# EAGLE design Soraduino_logsc (EAGLE 6.5.0)
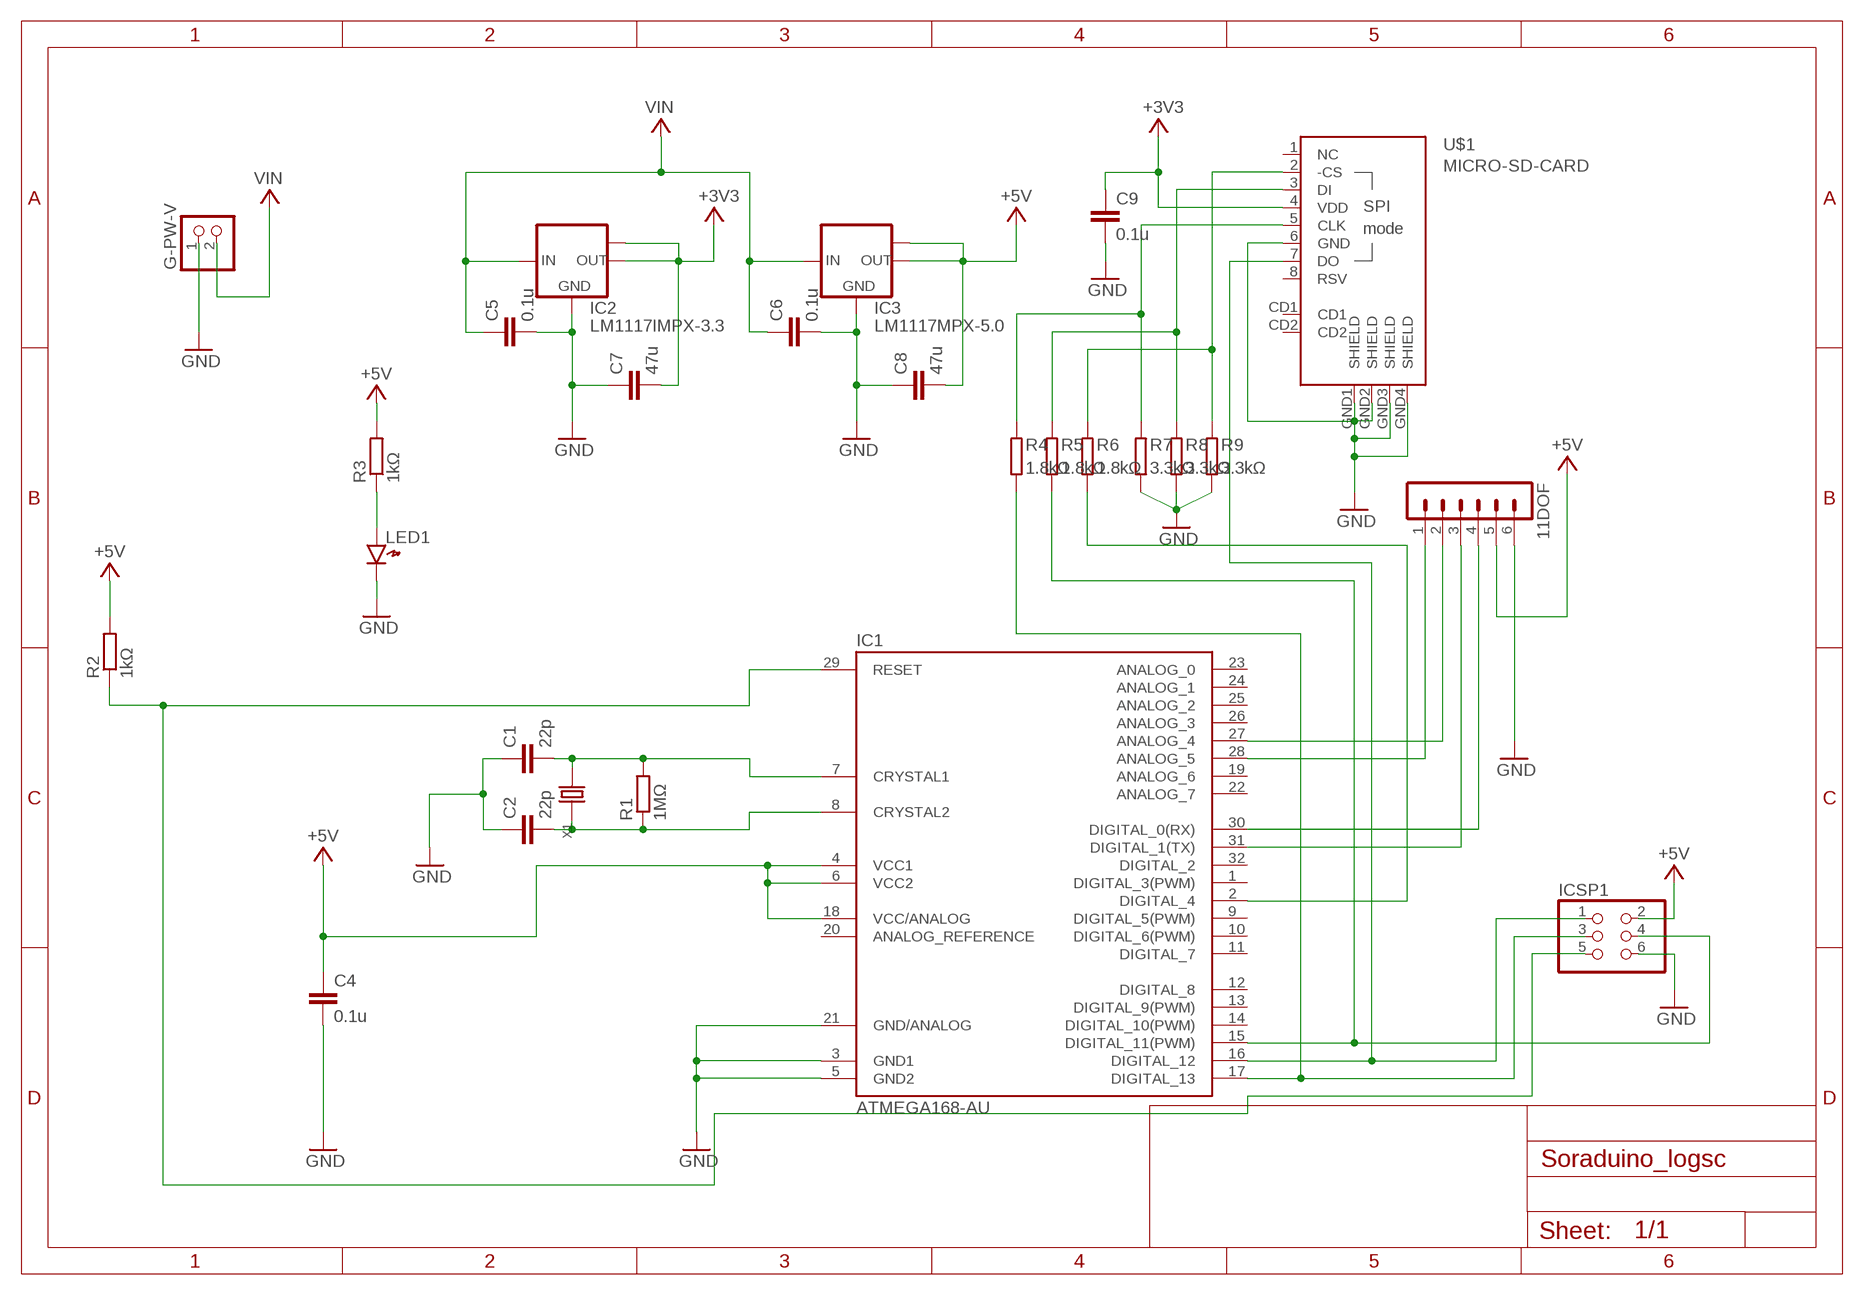
[diagram p0: schematic, sheet 1]

## Parts
11DOF  MA06-1  [MA06-1]
C1  22p  C-EUC1608  [C1608]
C2  22p  C-EUC1608  [C1608]
C4  0.1u  C-EUC2012  [C2012]
C5  0.1u  C-EUC2012  [C2012]
C6  0.1u  C-EUC2012  [C2012]
C7  47u  C-EUC3225  [C3225]
C8  47u  C-EUC3225  [C3225]
C9  0.1u  C-EUC2012  [C2012]
G-PW-V  PINHD-1X2  [1X02]
IC1  ATMEGA168-AU  [TQFP32-08]
IC2  LM1117IMPX-3.3  [SOT223]
IC3  LM1117MPX-5.0  [SOT223]
ICSP1  PINHD-2X3  [2X03]
LED1  LED1608  [LED1608]
R1  1MΩ  R-EU_R0603  [R0603]
R2  1kΩ  R-EU_R0603  [R0603]
R3  1kΩ  R-EU_R0603  [R0603]
R4  1.8kΩ  RESISTOR1608  [SMD1608]
R5  1.8kΩ  RESISTOR1608  [SMD1608]
R6  1.8kΩ  RESISTOR1608  [SMD1608]
R7  3.3kΩ  RESISTOR1608  [SMD1608]
R8  3.3kΩ  RESISTOR1608  [SMD1608]
R9  3.3kΩ  RESISTOR1608  [SMD1608]
U$1  MICRO-SD-CARD  [DM3AT-SF-PEJ]
X1  CRYSTAL'3225'  [4P-SMD-3.2X2.5]

## Nets
+3V3: C7.2 C9.1 IC2.2(OUT) IC2.TAB(OUT1) U$1.4(VDD)
+5V: 11DOF.5 C4.1 C8.2 IC1.4(VCC1) IC1.6(VCC2) IC1.18(VCC/ANALOG) IC3.2(OUT) IC3.TAB(OUT1) ICSP1.2 R2.2 R3.2
GND: 11DOF.6 C1.1 C2.1 C4.2 C5.2 C6.2 C7.1 C8.1 C9.2 G-PW-V.1 IC1.3(GND1) IC1.5(GND2) IC1.21(GND/ANALOG) IC2.1(GND) IC3.1(GND) ICSP1.6 LED1.K R7.2 R8.2 R9.2 U$1.6(GND) U$1.GND1(SHIELD) U$1.GND2(SHIELD) U$1.GND3(SHIELD) U$1.GND4(SHIELD)
N$1: C1.2 IC1.7(CRYSTAL1) R1.2 X1.4
N$2: C2.2 IC1.8(CRYSTAL2) R1.1 X1.2
N$3: 11DOF.1 IC1.28(ANALOG_5)
N$4: IC1.29(RESET) ICSP1.5 R2.1
N$6: 11DOF.4 IC1.30(DIGITAL_0(RX))
N$7: LED1.A R3.1
N$8: 11DOF.2 IC1.27(ANALOG_4)
N$10: R4.1 R7.1 U$1.5(CLK)
N$11: IC1.2(DIGITAL_4) R6.2
N$12: R5.1 R8.1 U$1.3(DI)
N$13: R6.1 R9.1 U$1.2(-CS)
N$14: IC1.15(DIGITAL_11(PWM)) ICSP1.4 R5.2
N$15: IC1.16(DIGITAL_12) ICSP1.1 U$1.7(DO)
N$16: IC1.17(DIGITAL_13) ICSP1.3 R4.2
N$17: 11DOF.3 IC1.31(DIGITAL_1(TX))
VCC: C5.1 C6.1 G-PW-V.2 IC2.3(IN) IC3.3(IN) ; supply symbol labelled VIN
Unconnected: IC1.1(DIGITAL_3(PWM)) IC1.9(DIGITAL_5(PWM)) IC1.10(DIGITAL_6(PWM)) IC1.11(DIGITAL_7) IC1.12(DIGITAL_8) IC1.13(DIGITAL_9(PWM)) IC1.14(DIGITAL_10(PWM)) IC1.19(ANALOG_6) IC1.20(ANALOG_REFERENCE) IC1.22(ANALOG_7) IC1.23(ANALOG_0) IC1.24(ANALOG_1) IC1.25(ANALOG_2) IC1.26(ANALOG_3) IC1.32(DIGITAL_2) U$1.1(NC) U$1.8(RSV) U$1.CD1 U$1.CD2

## Library data of the parts
11DOF = con-lstb:MA06-1: PIN HEADER; OC_FARNELL: unknown; OC_NEWARK: unknown
C1 C2 C4-C9 = rcl:C-EU: CAPACITOR, European symbol
G-PW-V = pinhead:PINHD-1X2: PIN HEADER
IC1 = Arduino-AVR:ATMEGA168
IC2 = lm1117:LM1117IMPX-*
IC3 = lm1117:LM1117MPX-*
ICSP1 = pinhead:PINHD-2X3: PIN HEADER
LED1 = generic:LED: Generic LEDs
R1-R3 = rcl:R-EU_: RESISTOR, European symbol
R4-R9 = generic:RESISTOR: Generic Registor
U$1 = micro_sd:MICRO-SD-CARD: HIROSE microSD socket DM3AT-SF-PEJ
X1 = Discrete:CRYSTAL*: CRYSTAL

## Board
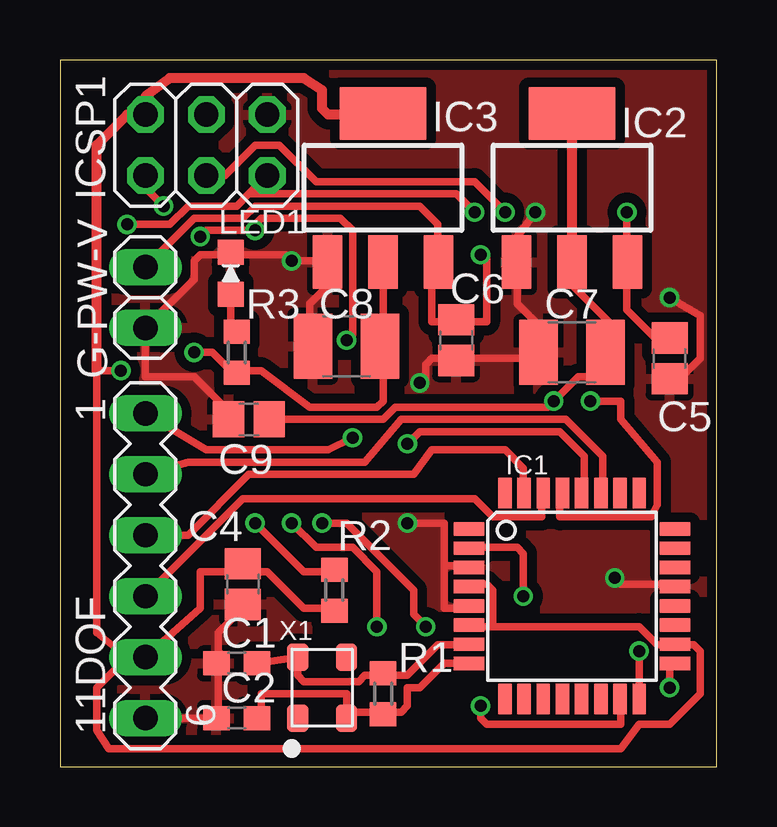
[diagram p1: board, top side]
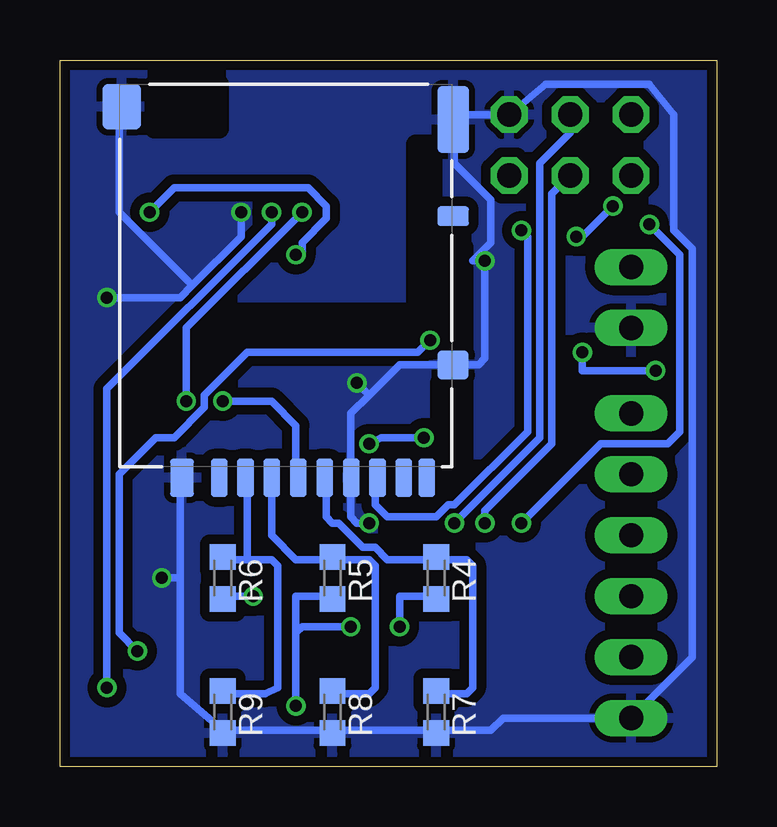
[diagram p2: board, bottom side, seen from below]

Size 27.36 x 29.45 mm. Coordinates in mm from the lower left corner, seen from the top.
Outline: 0,0 27.36,0 27.36,29.45 0,29.45 0,0
Copper layers (1*16): Top 0.035mm / dielectric 0.2mm / Bottom 0.035mm
Design rules "SeeedStudio_DRU_no_angle_20130527": minimum track width 6mil, minimum drill 12mil, track to track 6mil, track to pad 6mil, pad to pad 6mil, via to via 6mil, smd to smd 0mil, copper to edge 10mil, drill to drill 10mil, minimum pad ring 6mil, minimum via ring 6mil, stop-mask expansion 2mil, vias tented up to drill 25mil, thermal gap 10mil

### Footprints (pad centres in the part's own frame; a part is rotated, then mirrored left to right if it is on the bottom)
MA06-1 = drill 1.016 long: 1 -6.35,0; 2 -3.81,0; 3 -1.27,0; 4 1.27,0; 5 3.81,0; 6 6.35,0
C1608 = smd 1.1 x 1: 1 -0.85,0; 2 0.85,0
C2012 = smd 1.3 x 1.5: 1 -0.85,0; 2 0.85,0
C3225 = smd 1.6 x 2.7: 1 -1.4,0; 2 1.4,0
1X02 = drill 1.016 long: 1 -1.27,0; 2 1.27,0
TQFP32-08 = smd 1.27 x 0.559: 1 -4.293,2.8; 2 -4.293,2; 3 -4.293,1.2; 4 -4.293,0.4; 5 -4.293,-0.4; 6 -4.293,-1.2; 7 -4.293,-2; 8 -4.293,-2.8; 17 4.293,-2.8; 18 4.293,-2; 19 4.293,-1.2; 20 4.293,-0.4; 21 4.293,0.4; 22 4.293,1.2; 23 4.293,2; 24 4.293,2.8 | smd 0.559 x 1.27: 9 -2.8,-4.293; 10 -2,-4.293; 11 -1.2,-4.293; 12 -0.4,-4.293; 13 0.4,-4.293; 14 1.2,-4.293; 15 2,-4.293; 16 2.8,-4.293; 25 2.8,4.293; 26 2,4.293; 27 1.2,4.293; 28 0.4,4.293; 29 -0.4,4.293; 30 -1.2,4.293; 31 -2,4.293; 32 -2.8,4.293
SOT223 = smd 1.219 x 2.235: 1 -2.311,-3.099; 2 0,-3.099; 3 2.311,-3.099 | smd 3.6 x 2.2: TAB 0,3.099
2X03 = drill 1.016 octagon: 1 -2.54,-1.27; 2 -2.54,1.27; 3 0,-1.27; 4 0,1.27; 5 2.54,-1.27; 6 2.54,1.27
LED1608 = smd 1.05 x 1.08: A -0.875,0; K 0.875,0
R0603 = smd 1 x 1.1: 1 -0.85,0; 2 0.85,0
SMD1608 = smd 1.05 x 1.08: 1 -0.875,0; 2 0.875,0
DM3AT-SF-PEJ = smd 0.7 x 1.6: 1 3.2,16.4; 2 2.1,16.4; 3 1,16.4; 4 -0.1,16.4; 5 -1.2,16.4; 6 -2.3,16.4; 7 -3.4,16.4; 8 -4.5,16.4; CD1 -5.45,16.4 | smd 1.3 x 0.8: CD2 -6.55,5.5 | smd 1.3 x 2.8: GND1 -6.55,1.475 | smd 1.6 x 1.9: GND2 7.25,0.95 | smd 1 x 1.6: GND3 4.75,16.4 | smd 1.3 x 1.2: GND4 -6.55,11.7
4P-SMD-3.2X2.5 = smd 1.143 x 0.889: 1 -1.27,1.016; 2 -1.27,-1.016; 3 1.27,-1.016; 4 1.27,1.016

### Placement (x,y rotation side)
11DOF  3.56,8.38 270 top
C1  7.37,4.32 0 top
C2  7.37,2.03 0 top
C4  7.62,7.62 270 top
C5  25.4,17.02 270 top
C6  16.51,17.78 270 top
C7  21.34,17.27 0 top
C8  11.94,17.53 0 top
C9  7.87,14.48 180 top
G-PW-V  3.56,19.56 90 top
IC1  21.34,7.11 0 top
IC2  21.34,24.13 0 top
IC3  13.46,24.13 0 top
ICSP1  6.1,25.91 0 top
LED1  7.11,20.57 90 top
R1  13.46,3.05 90 top
R2  11.43,7.37 270 top
R3  7.37,17.27 270 top
R4  11.68,7.87 270 bottom
R5  16,7.87 270 bottom
R6  20.57,7.87 270 bottom
R7  11.68,2.29 270 bottom
R8  16,2.29 270 bottom
R9  20.57,2.29 270 bottom
U$1  17.53,28.45 180 bottom
X1  10.92,3.3 90 top

### Tracks (layer width: path | path; a pad name or v marks a point on that pad's centre or on a via)
+3V3  (via drill 0.5 pad 0.3)
  Top 0.305: 22.86,17.27 22.86,18.54 21.34,20.07 IC2.2 | 21.34,26.92 21.08,27.18 21.34,27.43 | 22.86,17.27 22.86,16.51 22.61,16.26 21.59,16.26 v20.57,15.24 20.32,14.99 13.97,14.99 13.46,14.48 C9.1 8.64,14.48 | 22.86,17.27 C7.2
  Top 0.406: 21.34,27.43 IC2.TAB 21.34,26.92 IC2.2
  Bottom 0.305: v20.57,15.24 18.54,15.24 17.53,14.22 17.53,12.19 U$1.4
+5V  (via drill 0.5 pad 0.3)
  Top 0.305: 18.03,5.84 17.27,5.84 IC1.6 | 18.03,5.84 24.13,5.84 24.89,5.08 25.4,5.08 IC1.18 25.65,5.08 26.42,5.08 26.67,4.83 26.67,3.05 25.4,1.78 24.13,1.78 23.37,0.76 2.03,0.76 1.52,1.52 1.52,3.3 2.79,4.57 | 13.46,17.53 IC3.2 | 7.11,16.51 8.38,16.51 10.41,14.99 13.21,14.99 13.46,15.24 13.46,17.53 | 13.46,17.53 C8.2 | 2.79,4.57 1.52,5.59 1.52,16.51 v2.54,16.51 | 18.03,5.84 18.03,7.37 17.78,7.62 17.27,7.62 IC1.4 | 7.87,8.13 8.64,8.13 10.16,6.6 11.43,6.6 R2.2 | 2.79,4.57 11DOF.5 5.84,6.6 5.84,8.13 7.87,8.13 | 7.11,16.51 R3.2 | 7.87,8.13 C4.1 | 7.11,16.51 6.35,17.27 v5.59,17.27
  Top 0.406: IC3.TAB 13.46,27.18 11.18,27.18 10.92,27.43 10.92,28.19 10.16,28.7 4.57,28.7 3.56,27.94 ICSP1.2 2.79,27.18 1.52,25.91 1.52,16.51
  Bottom 0.305: v5.59,17.27 5.59,16.51 v2.54,16.51
GND  (via drill 0.5 pad 0.3)
  Top 0.305: 11DOF.6 C2.1 6.6,2.03 6.6,4.32 | 6.6,4.32 6.6,4.57 C1.1 6.6,4.32 | 7.11,21.34 9.4,21.34 v9.65,21.08 10.92,21.08 IC3.1 11.18,20.83 11.18,20.07 10.41,19.3 10.41,17.53 C8.1 | v23.11,7.87 23.37,7.62 25.4,7.62 IC1.21 | 7.11,21.34 5.84,21.34 5.59,21.08 5.59,20.32 G-PW-V.1 3.56,16.26 5.59,16.26 7.11,14.73 7.11,14.48 C9.2 | 7.11,21.34 LED1.K | 16.51,17.02 19.81,17.02 20.07,17.27 C7.1 19.81,17.27 19.81,18.54 19.05,19.3 19.05,20.83 IC2.1 19.05,21.08 19.05,22.1 v19.81,23.11 | 16.51,17.02 15.49,17.02 15.24,16.76 15.24,16 v14.99,16 | 16.51,17.02 C6.2 | 16,8.38 17.02,8.38 IC1.3 | 16,8.38 16,6.6 17.02,6.6 IC1.5 | 16,8.38 16,10.16 v14.48,10.16 | 6.6,4.32 6.86,4.57 6.6,4.83 6.6,5.59 7.62,6.6 7.87,6.6 C4.2 | v25.4,19.56 26.67,18.8 26.67,17.02 25.91,16.26 25.49,16.26 C5.2
  Bottom 0.305: 16,1.52 11.68,1.52 | 16,1.52 20.57,1.52 | 16,1.52 R8.2 | 14.48,15.49 13.21,16.76 11.18,16.76 U$1.GND4 10.92,16.76 9.91,16.76 9.65,17.02 v9.65,21.08 10.16,21.08 9.4,21.84 9.4,23.62 10.92,25.15 10.92,26.92 U$1.GND1 10.92,27.18 ICSP1.6 7.11,28.45 2.79,28.45 1.78,27.18 1.78,22.35 1.02,21.59 1.02,4.57 11DOF.6 8.89,2.03 9.4,1.52 11.68,1.52 | 14.48,15.49 15.24,14.73 15.24,12.19 U$1.6 15.24,11.94 15.24,10.41 14.99,10.16 v14.48,10.16 | 11.68,1.52 R7.2 | 22.35,7.87 22.35,11.94 U$1.GND3 | v23.11,7.87 22.35,7.87 | 14.48,15.49 v14.99,16 | 21.84,20.07 19.81,22.1 v19.81,23.11 | 21.84,20.07 24.89,23.11 24.89,27.43 U$1.GND2 | 20.57,1.52 22.35,3.05 22.35,7.87 | 20.57,1.52 R9.2 | 21.84,20.07 22.35,19.56 v25.4,19.56
  pour Bottom (isolate 0.406): 0,29.46 27.43,29.46 27.43,0 0,0
  pour Top (isolate 0.406): 0,29.46 27.43,29.46 27.43,0 0,0
N$1
  Top 0.305: 13.46,3.81 14.48,3.81 15.75,5.08 17.02,5.08 IC1.7 | 13.46,3.81 12.7,3.81 12.45,3.56 10.16,3.56 9.91,3.81 X1.4 C1.2 | 13.46,3.81 R1.2
N$2
  Top 0.305: 13.46,2.29 14.22,2.29 14.48,2.54 14.48,3.3 14.99,3.3 16,4.32 17.02,4.32 IC1.8 | 13.46,2.29 11.94,2.29 X1.2 11.94,3.05 8.38,3.05 8.38,2.03 C2.2 | 13.46,2.29 R1.1
N$3  (via drill 0.5)
  Top 0.305: v14.48,13.46 14.99,13.97 20.83,13.97 21.84,12.95 21.84,11.43 IC1.28 | v12.19,13.72 11.18,13.21 6.1,13.21 11DOF.1
  Bottom 0.305: v14.48,13.46 13.97,13.72 v12.19,13.72
N$4  (via drill 0.5 pad 0.3)
  Top 0.305: v8.13,10.16 10.16,8.13 11.43,8.13 R2.1 | v2.79,22.61 4.57,22.61 5.33,23.37 7.37,23.37 7.87,23.88 | ICSP1.5 7.87,23.88 | v22.1,15.24 23.37,15.24 23.37,14.48 24.89,12.7 24.89,10.92 24.64,10.41 20.83,10.41 20.83,11.18 IC1.29 | v17.27,23.11 16.51,23.88 7.87,23.88
  Bottom 0.305: v8.13,10.16 4.83,13.46 2.03,13.46 1.52,13.97 1.52,21.34 v2.79,22.61 | v22.1,15.24 22.1,18.29 v17.27,23.11
N$6
  Top 0.305: 11DOF.4 7.62,11.18 17.27,11.18 18.03,10.41 20.07,10.41 20.07,11.18 IC1.30
N$7
  Top 0.305: 7.11,18.03 R3.1 7.11,18.12 LED1.A
N$8
  Top 0.305: 11DOF.2 5.33,12.7 12.7,12.7 14.22,14.48 21.08,14.48 22.61,12.95 22.61,11.43 IC1.27
N$10
  Bottom 0.305: 11.68,8.64 13.72,8.64 14.22,9.14 14.73,9.14 15.75,10.16 16,10.16 16.26,10.41 16.26,11.94 U$1.5 | 11.68,8.64 10.41,8.64 10.16,8.38 10.16,3.3 10.41,3.05 11.68,3.05 R7.1 | 11.68,8.64 R4.1
N$11  (via drill 0.5 pad 0.3)
  Top 0.305: v19.3,7.11 19.3,8.89 19.05,9.14 17.27,9.14 IC1.2
  Bottom 0.305: v19.3,7.11 20.57,7.11 R6.2
N$12
  Bottom 0.305: 16,8.64 17.53,8.64 18.54,9.65 18.54,11.94 U$1.3 | 16,8.64 14.48,8.64 14.22,8.38 14.22,3.3 14.48,3.05 16,3.05 R8.1 | 16,8.64 R5.1
N$13
  Bottom 0.305: 19.56,8.64 20.57,8.64 R6.1 | 19.56,8.64 19.56,11.94 U$1.2 | 19.56,8.64 18.54,8.64 18.29,8.38 18.29,3.3 18.8,3.05 20.57,3.05 R9.1
N$14  (via drill 0.5 pad 0.3)
  Top 0.305: v17.53,2.54 17.53,2.03 17.78,1.78 23.37,1.78 23.37,2.79 IC1.15 | v10.92,10.16 11.94,10.16 14.73,7.37 14.73,6.35 v15.24,5.84
  Bottom 0.305: v17.53,2.54 17.53,5.59 | 17.53,5.59 17.53,7.11 16,7.11 R5.2 | ICSP1.4 6.1,26.42 7.37,25.15 7.37,13.72 v10.92,10.16 | v15.24,5.84 17.27,5.84 17.53,5.59
N$15  (via drill 0.5)
  Top 0.305: ICSP1.1 3.56,24.13 v4.32,23.37 | v5.84,22.1 6.1,22.35 7.87,22.35 | 7.87,22.35 8.38,22.86 11.68,22.86 12.19,22.35 12.19,18.03 v11.94,17.78 | v24.13,4.83 24.13,3.05 IC1.16 | 7.87,22.35 v8.13,22.35
  Bottom 0.305: v4.32,23.37 5.59,22.1 v5.84,22.1 | v11.94,17.78 12.45,17.27 19.56,17.27 21.34,15.49 21.34,14.99 22.61,13.72 23.37,13.72 24.89,12.19 24.89,5.59 v24.13,4.83 | v8.13,22.35 7.87,22.1 7.87,13.97 10.92,10.92 11.18,10.92 11.68,10.41 13.72,10.41 14.22,10.92 14.22,11.94 U$1.7
N$16  (via drill 0.5 pad 0.3)
  Top 0.305: v13.21,5.84 13.21,8.13 12.19,9.14 10.67,9.14 v9.65,10.16 | v25.4,3.3 25.4,4.06 IC1.17 | v18.54,23.11 17.27,24.38 10.67,24.38 9.14,25.91 8.13,25.91 6.86,24.64 ICSP1.3
  Bottom 0.305: R4.2 11.68,7.11 13.21,7.11 v13.21,5.84 | v9.65,10.16 9.65,10.67 6.86,13.46 6.86,23.88 ICSP1.3 | v25.4,3.3 25.4,15.75 18.54,22.61 v18.54,23.11
N$17
  Top 0.305: 11DOF.3 5.33,9.65 7.87,12.19 14.73,12.19 15.49,13.21 18.54,13.21 19.3,12.45 19.3,11.43 IC1.31
VCC  (via drill 0.5 pad 0.3)
  Top 0.305: G-PW-V.2 5.59,22.86 7.62,22.86 8.13,23.37 14.99,23.37 15.75,22.61 15.75,21.08 IC3.3 15.49,20.83 15.49,18.54 16.51,18.54 | C5.1 25.4,17.78 24.89,17.78 23.62,19.05 23.62,20.83 IC2.3 23.62,21.08 v23.62,23.11 | 16.51,18.54 17.78,18.54 17.78,21.34 v17.53,21.34 | 16.51,18.54 C6.1
  Bottom 0.305: v17.53,21.34 17.27,21.34 17.27,21.84 16.26,22.86 16.26,23.37 17.02,24.13 22.61,24.13 v23.62,23.11